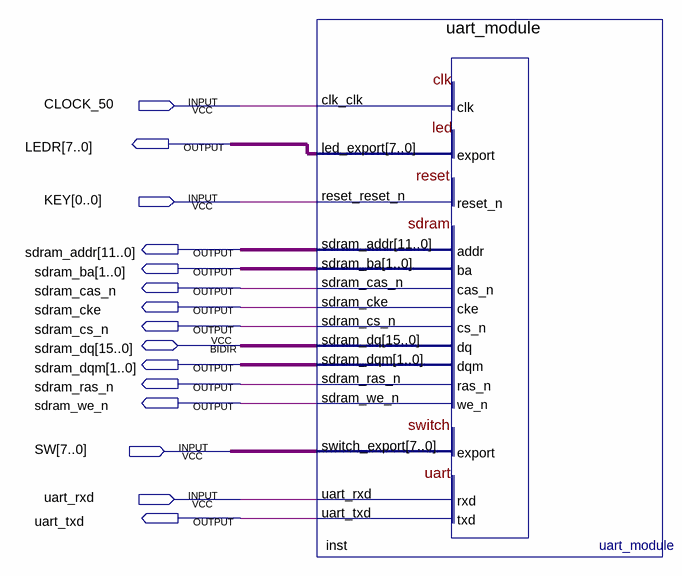
[diagram p0: schematic sheet]
// Quartus schematic uart.bdf as structural Verilog: 1 symbols, 15 pins
module uart (
  input  CLOCK_50,
  input  [0:0] KEY,
  input  [7:0] SW,
  input  uart_rxd,
  inout  [15:0] sdram_dq,
  output [7:0] LEDR,
  output [11:0] sdram_addr,
  output [1:0] sdram_ba,
  output sdram_cas_n,
  output sdram_cke,
  output sdram_cs_n,
  output [1:0] sdram_dqm,
  output sdram_ras_n,
  output sdram_we_n,
  output uart_txd
);

  uart_module inst (
    .clk_clk(CLOCK_50), .reset_reset_n(KEY[0]), .switch_export(SW), .uart_rxd(uart_rxd), .led_export(LEDR),
    .sdram_addr(sdram_addr), .sdram_ba(sdram_ba), .sdram_cas_n(sdram_cas_n), .sdram_cke(sdram_cke),
    .sdram_cs_n(sdram_cs_n), .sdram_dqm(sdram_dqm), .sdram_ras_n(sdram_ras_n), .sdram_we_n(sdram_we_n),
    .uart_txd(uart_txd), .sdram_dq(sdram_dq));
endmodule
